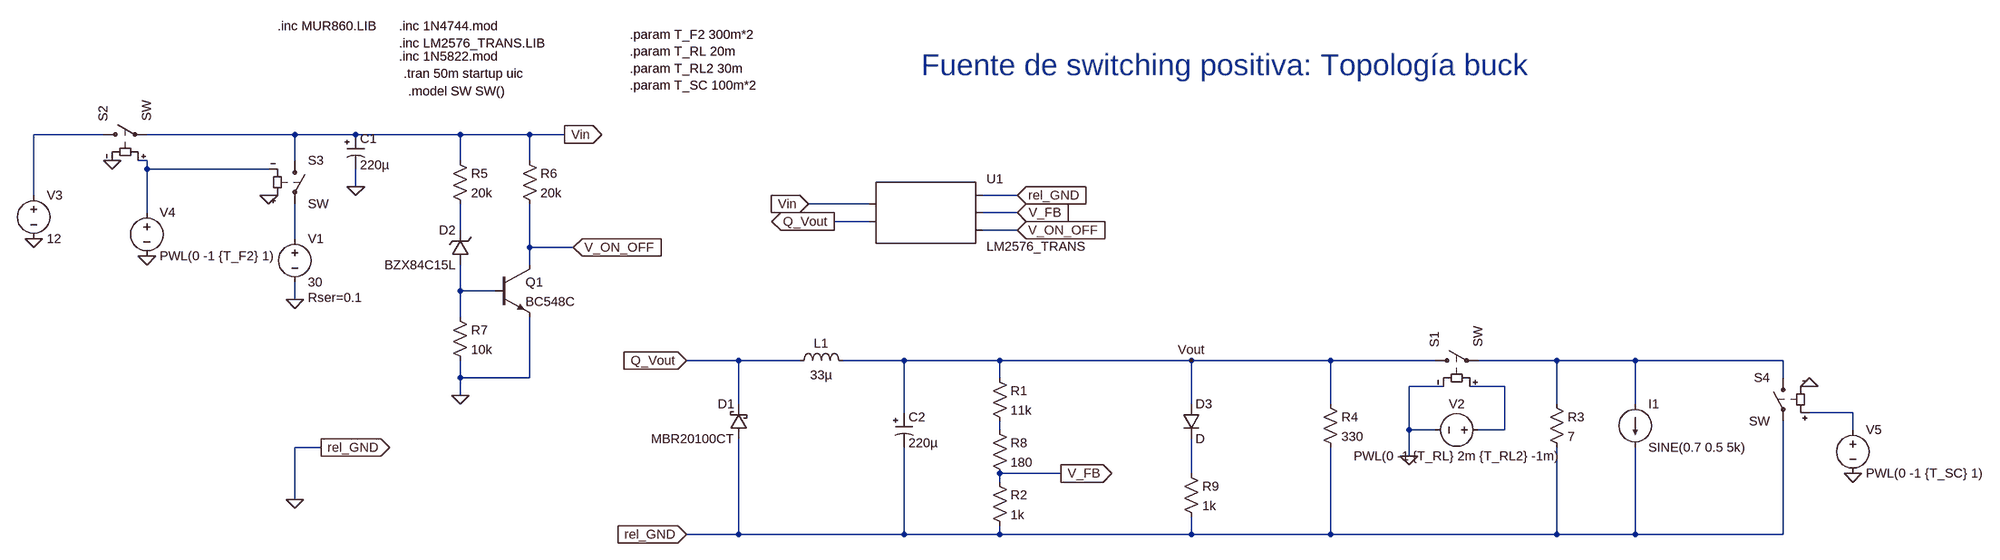
[diagram p0: schematic step_down_LM2576.asc]
step_down_LM2576.asc, the LTspice schematic file:
Version 4
SHEET 1 2656 856
WIRE -832 48 -960 48
WIRE -480 48 -752 48
WIRE -368 48 -480 48
WIRE -176 48 -368 48
WIRE -48 48 -176 48
WIRE 16 48 -48 48
WIRE -752 96 -768 96
WIRE -480 96 -480 48
WIRE -176 96 -176 48
WIRE -48 96 -48 48
WIRE -752 112 -752 96
WIRE -528 112 -752 112
WIRE -368 144 -368 112
WIRE -960 160 -960 48
WIRE 848 160 784 160
WIRE 576 176 464 176
WIRE -752 192 -752 112
WIRE 848 192 784 192
WIRE 576 208 512 208
WIRE -176 224 -176 176
WIRE 848 224 784 224
WIRE -480 240 -480 176
WIRE -48 256 -48 176
WIRE 32 256 -48 256
WIRE -48 288 -48 256
WIRE -176 336 -176 288
WIRE -112 336 -176 336
WIRE -480 352 -480 320
WIRE -176 384 -176 336
WIRE 336 464 240 464
WIRE 448 464 336 464
WIRE 640 464 528 464
WIRE 816 464 640 464
WIRE 1168 464 816 464
WIRE 1424 464 1168 464
WIRE 1616 464 1424 464
WIRE 1840 464 1696 464
WIRE 1984 464 1840 464
WIRE 2256 464 1984 464
WIRE -176 496 -176 464
WIRE -48 496 -48 384
WIRE -48 496 -176 496
WIRE 816 496 816 464
WIRE 2256 496 2256 464
WIRE 1632 512 1568 512
WIRE 1744 512 1680 512
WIRE -176 528 -176 496
WIRE 336 544 336 464
WIRE 1168 544 1168 464
WIRE 1424 544 1424 464
WIRE 1840 544 1840 464
WIRE 1984 544 1984 464
WIRE 640 560 640 464
WIRE 2384 560 2304 560
WIRE 816 592 816 576
WIRE 1568 592 1568 512
WIRE 1616 592 1568 592
WIRE 1744 592 1744 512
WIRE 1744 592 1696 592
WIRE 2384 592 2384 560
WIRE -432 624 -480 624
WIRE 1568 640 1568 592
WIRE 928 672 816 672
WIRE 1168 672 1168 608
WIRE 816 688 816 672
WIRE -480 720 -480 624
WIRE 336 784 336 608
WIRE 336 784 240 784
WIRE 640 784 640 624
WIRE 640 784 336 784
WIRE 816 784 816 768
WIRE 816 784 640 784
WIRE 1168 784 1168 752
WIRE 1168 784 816 784
WIRE 1424 784 1424 624
WIRE 1424 784 1168 784
WIRE 1840 784 1840 624
WIRE 1840 784 1424 784
WIRE 1984 784 1984 624
WIRE 1984 784 1840 784
WIRE 2256 784 2256 576
WIRE 2256 784 1984 784
FLAG -480 352 0
FLAG -480 720 0
FLAG 16 48 Vin
IOPIN 16 48 Out
FLAG -432 624 rel_GND
IOPIN -432 624 Out
FLAG 464 176 Vin
IOPIN 464 176 In
FLAG 848 160 rel_GND
IOPIN 848 160 In
FLAG 512 208 Q_Vout
IOPIN 512 208 Out
FLAG 240 464 Q_Vout
IOPIN 240 464 In
FLAG 928 672 V_FB
IOPIN 928 672 Out
FLAG 848 192 V_FB
IOPIN 848 192 In
FLAG 240 784 rel_GND
IOPIN 240 784 In
FLAG 1568 640 0
FLAG -368 144 0
FLAG -176 528 0
FLAG 848 224 V_ON_OFF
IOPIN 848 224 In
FLAG 32 256 V_ON_OFF
IOPIN 32 256 In
FLAG -960 240 0
FLAG -752 272 0
FLAG -816 96 0
FLAG -528 160 0
FLAG 2384 672 0
FLAG 2304 512 0
FLAG 1168 464 Vout
SYMBOL AutoGenerated\\LM2576_TRANS 672 192 R0
SYMATTR InstName U1
SYMBOL voltage -480 224 R0
WINDOW 123 0 0 Left 2
WINDOW 39 24 124 Left 2
SYMATTR SpiceLine Rser=0.1
SYMATTR InstName V1
SYMATTR Value 30
SYMBOL polcap -384 48 R0
WINDOW 3 24 56 Left 2
SYMATTR Value 220µ
SYMATTR InstName C1
SYMATTR Description Capacitor
SYMATTR Type cap
SYMATTR SpiceLine V=63 Irms=465m Rser=0.2 Lser=0 mfg="Nichicon" pn="UPR1J221MPH" type="Al electrolytic"
SYMBOL ind 432 480 R270
WINDOW 0 32 56 VTop 2
WINDOW 3 5 56 VBottom 2
SYMATTR InstName L1
SYMATTR Value 33µ
SYMATTR SpiceLine Ipk=10.3 Rser=0.0023 Rpar=3108.6 Cpar=0 mfg="Coilcraft" pn="VER2923-333"
SYMBOL polcap 624 560 R0
WINDOW 3 24 56 Left 2
SYMATTR Value 220µ
SYMATTR InstName C2
SYMATTR Description Capacitor
SYMATTR Type cap
SYMATTR SpiceLine V=63 Irms=1.45 Rser=0.07 Lser=0 mfg="Panasonic" pn="ECA1JFQ471" type="Al electrolytic"
SYMBOL res 800 480 R0
SYMATTR InstName R1
SYMATTR Value 11k
SYMBOL res 800 672 R0
SYMATTR InstName R2
SYMATTR Value 1k
SYMBOL res 1824 528 R0
SYMATTR InstName R3
SYMATTR Value 7
SYMBOL current 1984 544 R0
WINDOW 123 0 0 Left 2
WINDOW 39 0 0 Left 2
SYMATTR InstName I1
SYMATTR Value SINE(0.7 0.5 5k)
SYMBOL schottky 352 608 R180
WINDOW 0 24 64 Left 2
WINDOW 3 24 0 Left 2
SYMATTR InstName D1
SYMATTR Value MBR20100CT
SYMBOL sw 1600 464 R270
SYMATTR InstName S1
SYMBOL voltage 1712 592 R90
WINDOW 0 -32 56 VBottom 2
WINDOW 3 32 56 VTop 2
WINDOW 123 0 0 Left 2
WINDOW 39 0 0 Left 2
SYMATTR InstName V2
SYMATTR Value PWL(0 -1 {T_RL} 2m {T_RL2} -1m)
SYMBOL res 1408 528 R0
SYMATTR InstName R4
SYMATTR Value 330
SYMBOL res -192 80 R0
SYMATTR InstName R5
SYMATTR Value 20k
SYMBOL res -64 80 R0
SYMATTR InstName R6
SYMATTR Value 20k
SYMBOL res -192 368 R0
SYMATTR InstName R7
SYMATTR Value 10k
SYMBOL npn -112 288 R0
SYMATTR InstName Q1
SYMATTR Value BC548C
SYMBOL zener -160 288 R180
WINDOW 0 24 64 Left 2
WINDOW 3 24 0 Left 2
SYMATTR InstName D2
SYMATTR Value BZX84C15L
SYMBOL sw -848 48 R270
SYMATTR InstName S2
SYMBOL sw -480 80 R0
SYMATTR InstName S3
SYMBOL voltage -960 144 R0
SYMATTR InstName V3
SYMATTR Value 12
SYMBOL voltage -752 176 R0
WINDOW 123 0 0 Left 2
WINDOW 39 0 0 Left 2
SYMATTR InstName V4
SYMATTR Value PWL(0 -1 {T_F2} 1)
SYMBOL sw 2256 480 M0
SYMATTR InstName S4
SYMBOL voltage 2384 576 R0
WINDOW 123 0 0 Left 2
WINDOW 39 0 0 Left 2
SYMATTR InstName V5
SYMATTR Value PWL(0 -1 {T_SC} 1)
SYMBOL res 800 576 R0
SYMATTR InstName R8
SYMATTR Value 180
SYMBOL res 1152 656 R0
SYMATTR InstName R9
SYMATTR Value 1k
SYMBOL diode 1152 544 R0
SYMATTR InstName D3
TEXT -288 -120 Left 2 !.inc LM2576_TRANS.LIB
TEXT -288 -96 Left 2 !.inc 1N5822.mod
TEXT -280 -64 Left 2 !.tran 50m startup uic
TEXT -272 -32 Left 2 !.model SW SW()
TEXT -288 -152 Left 2 !.inc 1N4744.mod
TEXT 136 -136 Left 2 !.param T_F2 300m*2\n.param T_RL 20m\n.param T_RL2 30m\n.param T_SC 100m*2
TEXT -512 -152 Left 2 !.inc MUR860.LIB
TEXT 672 -80 Left 5 ;Fuente de switching positiva: Topología buck

The netlist it stands for:
* step_down_LM2576.asc
* U1: LM2576_TRANS (symbol AutoGenerated\LM2576_TRANS not available, pins judged from their places): pin1=Vin pin2=Q_Vout pin3=0 pin4=V_FB pin5=V_ON_OFF
V1 N004 0 30 Rser=0.1
C1 Vin 0 220µ V=63 Irms=465m Rser=0.2 Lser=0 mfg="Nichicon" pn="UPR1J221MPH" type="Al electrolytic"
L1 Q_Vout Vout 33µ Ipk=10.3 Rser=0.0023 Rpar=3108.6 Cpar=0 mfg="Coilcraft" pn="VER2923-333"
C2 Vout 0 220µ V=63 Irms=1.45 Rser=0.07 Lser=0 mfg="Panasonic" pn="ECA1JFQ471" type="Al electrolytic"
R1 Vout N009 11k
R2 V_FB 0 1k
R3 N006 0 7
I1 N006 0 SINE(0.7 0.5 5k)
D1 0 Q_Vout MBR20100CT
S1 Vout N006 N007 0 SW
V2 N007 0 PWL(0 -1 {T_RL} 2m {T_RL2} -1m)
R4 Vout 0 330
R5 Vin N003 20k
R6 Vin V_ON_OFF 20k
R7 N005 0 10k
Q1 V_ON_OFF N005 0 0 BC548C
D2 N005 N003 BZX84C15L
S2 N001 Vin N002 0 SW
S3 Vin N004 0 N002 SW
V3 N001 0 12
V4 N002 0 PWL(0 -1 {T_F2} 1)
S4 N006 0 N008 0 SW
V5 N008 0 PWL(0 -1 {T_SC} 1)
R8 N009 V_FB 180
R9 N010 0 1k
D3 Vout N010 D
.model D D
.lib standard.dio
.model NPN NPN
.model PNP PNP
.lib standard.bjt
.inc LM2576_TRANS.LIB
.inc 1N5822.mod
.tran 50m startup uic
.model SW SW()
.inc 1N4744.mod
.param T_F2 300m*2
.param T_RL 20m
.param T_RL2 30m
.param T_SC 100m*2
.inc MUR860.LIB
* Fuente de switching positiva: Topología buck
.backanno
.end